# EAGLE design TeensyBreakoutBoard (EAGLE 8.6.0)
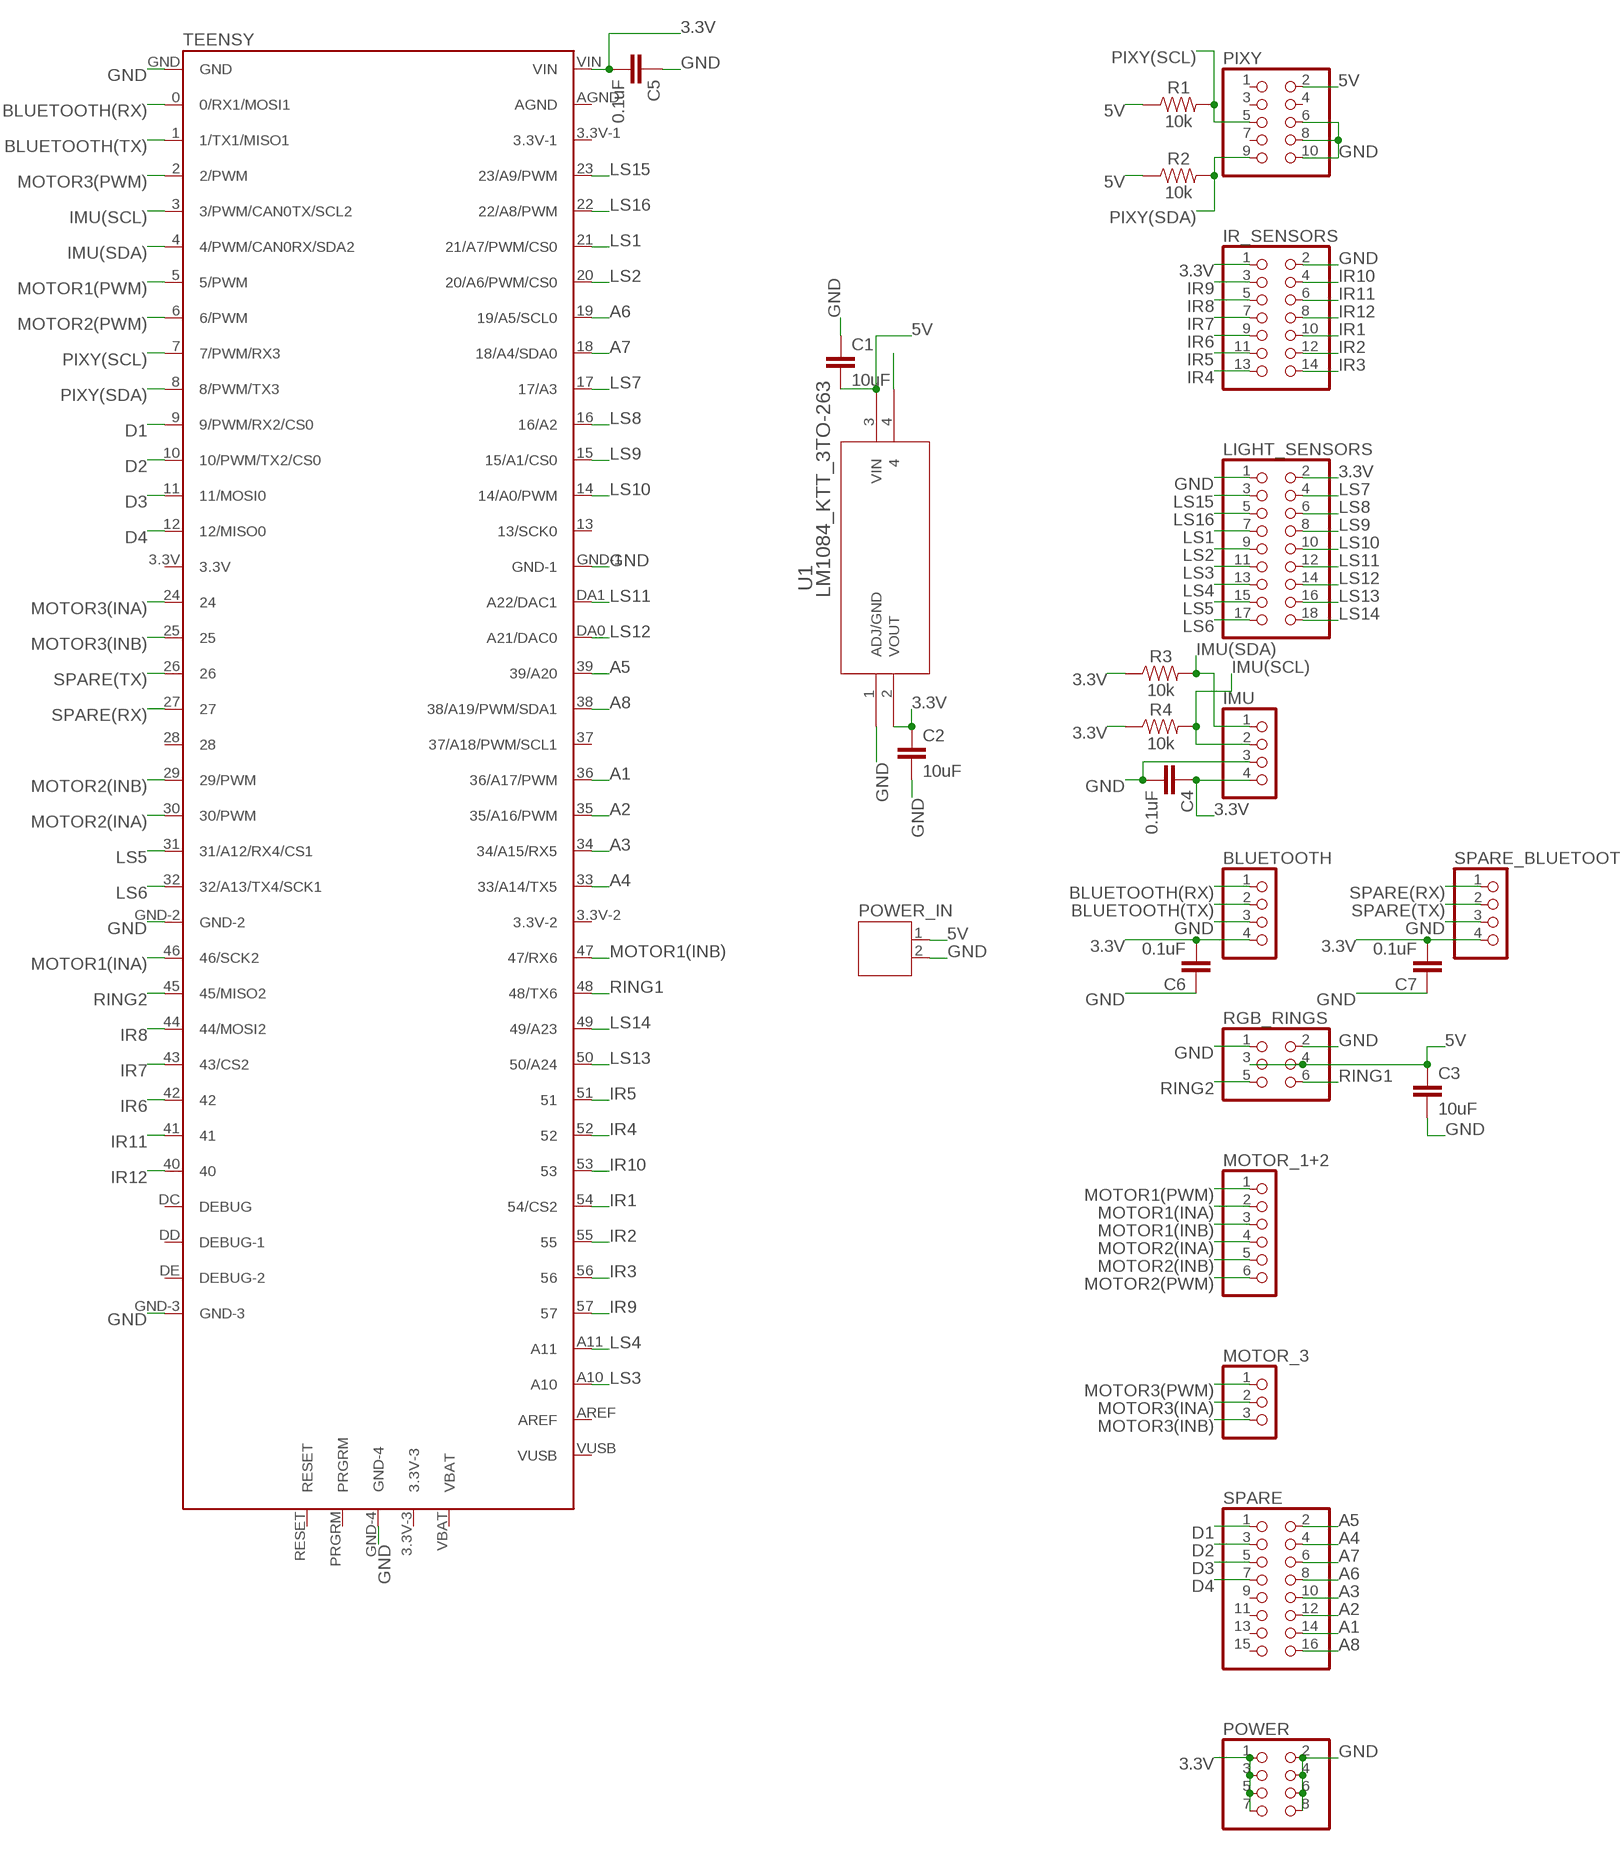
[diagram p0: schematic, sheet 1]

## Parts
BLUETOOTH  PINHD-1X4  [1X04]
C1  10uF  10UF-0805-10V-10%  [0805]
C2  10uF  10UF-0805-10V-10%  [0805]
C3  10uF  10UF-0805-10V-10%  [0805]
C4  0.1uF  0.1UF-0603-25V-(+80/-20%)  [0603]
C5  0.1uF  0.1UF-0603-25V-(+80/-20%)  [0603]
C6  0.1uF  0.1UF-0603-25V-(+80/-20%)  [0603]
C7  0.1uF  0.1UF-0603-25V-(+80/-20%)  [0603]
IMU  PINHD-1X4  [1X04]
IR_SENSORS  PINHD-2X7  [2X07]
LIGHT_SENSORS  PINHD-2X9  [2X09]
MOTOR_1+2  PINHD-1X6  [1X06]
MOTOR_3  PINHD-1X3  [1X03]
PIXY  PINHD-2X5  [2X05]
POWER  PINHD-2X4  [2X04]
POWER_IN  JST-PH2  [JST-PH2]
R1  10k  10KOHM-0603-1/10W-1%  [0603]
R2  10k  10KOHM-0603-1/10W-1%  [0603]
R3  10k  10KOHM-0603-1/10W-1%  [0603]
R4  10k  10KOHM-0603-1/10W-1%  [0603]
RGB_RINGS  PINHD-2X3  [2X03]
SPARE  PINHD-2X8  [2X08]
SPARE_BLUETOOTH  PINHD-1X4  [1X04]
TEENSY  TEENSY-3.5  [TEENSY-3.5]
U1  LM1084_KTT_3TO-263  [TS3B]

## Nets
3.3V: BLUETOOTH.4 C2.1 C4.1 C5.2 C6.2 C7.2 IMU.4 IR_SENSORS.1 LIGHT_SENSORS.2 POWER.1 POWER.3 POWER.5 POWER.7 R3.1 R4.1 SPARE_BLUETOOTH.4 TEENSY.VIN U1.2(VOUT)
5V: C1.2 C3.1 PIXY.2 POWER_IN.1 R1.1 R2.1 RGB_RINGS.3 RGB_RINGS.4 U1.3(VIN)
A1: SPARE.14 TEENSY.36(36/A17/PWM)
A2: SPARE.12 TEENSY.35(35/A16/PWM)
A3: SPARE.10 TEENSY.34(34/A15/RX5)
A4: SPARE.4 TEENSY.33(33/A14/TX5)
A5: SPARE.2 TEENSY.39(39/A20)
A6: SPARE.8 TEENSY.19(19/A5/SCL0)
A7: SPARE.6 TEENSY.18(18/A4/SDA0)
A8: SPARE.16 TEENSY.38(38/A19/PWM/SDA1)
BLUETOOTH(RX): BLUETOOTH.1 TEENSY.0(0/RX1/MOSI1)
BLUETOOTH(TX): BLUETOOTH.2 TEENSY.1(1/TX1/MISO1)
D1: SPARE.1 TEENSY.9(9/PWM/RX2/CS0)
D2: SPARE.3 TEENSY.10(10/PWM/TX2/CS0)
D3: SPARE.5 TEENSY.11(11/MOSI0)
D4: SPARE.7 TEENSY.12(12/MISO0)
GND: BLUETOOTH.3 C1.1 C2.2 C3.2 C4.2 C5.1 C6.1 C7.1 IMU.3 IR_SENSORS.2 LIGHT_SENSORS.1 PIXY.6 PIXY.8 PIXY.10 POWER.2 POWER.4 POWER.6 POWER.8 POWER_IN.2 RGB_RINGS.1 RGB_RINGS.2 SPARE_BLUETOOTH.3 TEENSY.GND TEENSY.GND-1 TEENSY.GND-2 TEENSY.GND-3 TEENSY.GND-4 U1.1(ADJ/GND)
IMU(SCL): IMU.2 R4.2 TEENSY.3(3/PWM/CAN0TX/SCL2)
IMU(SDA): IMU.1 R3.2 TEENSY.4(4/PWM/CAN0RX/SDA2)
IR1: IR_SENSORS.10 TEENSY.54(54/CS2)
IR2: IR_SENSORS.12 TEENSY.55
IR3: IR_SENSORS.14 TEENSY.56
IR4: IR_SENSORS.13 TEENSY.52
IR5: IR_SENSORS.11 TEENSY.51
IR6: IR_SENSORS.9 TEENSY.42
IR7: IR_SENSORS.7 TEENSY.43(43/CS2)
IR8: IR_SENSORS.5 TEENSY.44(44/MOSI2)
IR9: IR_SENSORS.3 TEENSY.57
IR10: IR_SENSORS.4 TEENSY.53
IR11: IR_SENSORS.6 TEENSY.41
IR12: IR_SENSORS.8 TEENSY.40
LS1: LIGHT_SENSORS.7 TEENSY.21(21/A7/PWM/CS0)
LS2: LIGHT_SENSORS.9 TEENSY.20(20/A6/PWM/CS0)
LS3: LIGHT_SENSORS.11 TEENSY.A10
LS4: LIGHT_SENSORS.13 TEENSY.A11
LS5: LIGHT_SENSORS.15 TEENSY.31(31/A12/RX4/CS1)
LS6: LIGHT_SENSORS.17 TEENSY.32(32/A13/TX4/SCK1)
LS7: LIGHT_SENSORS.4 TEENSY.17(17/A3)
LS8: LIGHT_SENSORS.6 TEENSY.16(16/A2)
LS9: LIGHT_SENSORS.8 TEENSY.15(15/A1/CS0)
LS10: LIGHT_SENSORS.10 TEENSY.14(14/A0/PWM)
LS11: LIGHT_SENSORS.12 TEENSY.DA1(A22/DAC1)
LS12: LIGHT_SENSORS.14 TEENSY.DA0(A21/DAC0)
LS13: LIGHT_SENSORS.16 TEENSY.50(50/A24)
LS14: LIGHT_SENSORS.18 TEENSY.49(49/A23)
LS15: LIGHT_SENSORS.3 TEENSY.23(23/A9/PWM)
LS16: LIGHT_SENSORS.5 TEENSY.22(22/A8/PWM)
MOTOR1(INA): MOTOR_1+2.2 TEENSY.46(46/SCK2)
MOTOR1(INB): MOTOR_1+2.3 TEENSY.47(47/RX6)
MOTOR1(PWM): MOTOR_1+2.1 TEENSY.5(5/PWM)
MOTOR2(INA): MOTOR_1+2.4 TEENSY.30(30/PWM)
MOTOR2(INB): MOTOR_1+2.5 TEENSY.29(29/PWM)
MOTOR2(PWM): MOTOR_1+2.6 TEENSY.6(6/PWM)
MOTOR3(INA): MOTOR_3.2 TEENSY.24
MOTOR3(INB): MOTOR_3.3 TEENSY.25
MOTOR3(PWM): MOTOR_3.1 TEENSY.2(2/PWM)
N$20: U1.4
PIXY(SCL): PIXY.5 R1.2 TEENSY.7(7/PWM/RX3)
PIXY(SDA): PIXY.9 R2.2 TEENSY.8(8/PWM/TX3)
RING1: RGB_RINGS.6 TEENSY.48(48/TX6)
RING2: RGB_RINGS.5 TEENSY.45(45/MISO2)
SPARE(RX): SPARE_BLUETOOTH.1 TEENSY.27
SPARE(TX): SPARE_BLUETOOTH.2 TEENSY.26
Unconnected: PIXY.1 PIXY.3 PIXY.4 PIXY.7 SPARE.9 SPARE.11 SPARE.13 SPARE.15 TEENSY.3.3V TEENSY.3.3V-1 TEENSY.3.3V-2 TEENSY.3.3V-3 TEENSY.13(13/SCK0) TEENSY.28 TEENSY.37(37/A18/PWM/SCL1) TEENSY.AGND TEENSY.AREF TEENSY.DC(DEBUG) TEENSY.DD(DEBUG-1) TEENSY.DE(DEBUG-2) TEENSY.PRGRM TEENSY.RESET TEENSY.VBAT TEENSY.VUSB

## Library data of the parts
BLUETOOTH IMU SPARE_BLUETOOTH = PinHead+:PINHD-1X4: PIN HEADER
C1-C3 = SparkFun-Capacitors:10UF: 10.0µF ceramic capacitors A capacitor is a passive two-terminal electrical component used to store electrical energy temporarily in an electric field.; PROD_ID: CAP-11330
C4-C7 = SparkFun-Capacitors:0.1UF: 0.1µF ceramic capacitors A capacitor is a passive two-terminal electrical component used to store electrical energy temporarily in an electric field.; PROD_ID: CAP-00810
IR_SENSORS = PinHead+:PINHD-2X7: PIN HEADER
LIGHT_SENSORS = PinHead+:PINHD-2X9: PIN HEADER
MOTOR_1+2 = PinHead+:PINHD-1X6: PIN HEADER
MOTOR_3 = PinHead+:PINHD-1X3: PIN HEADER
PIXY = PinHead+:PINHD-2X5: PIN HEADER
POWER = PinHead+:PINHD-2X4: PIN HEADER
POWER_IN = jst-ph:JST-PH2
R1-R4 = SparkFun-Resistors:10KOHM: 10kΩ resistor A resistor is a passive two-terminal electrical component that implements electrical resistance as a circuit element. Resistors act to reduce current flow, and, at the same time, act to lower voltage levels within circuits. - Wikipedia; PROD_ID: RES-00824
RGB_RINGS = PinHead+:PINHD-2X3: PIN HEADER
SPARE = PinHead+:PINHD-2X8: PIN HEADER
TEENSY = teensy-3.5:TEENSY-3.5
U1 = Andrew:LM1084_KTT_3; BASE_PN: LM1084; COMP: TypeLDO; LIBRARY: ReferenceLM1084IS; PARTNUMBER: LM1084IS-33; PIN: Count3; SYMBOL: NameLM1084IS-33; TYPE: LM1084IS-3.3; VENDOR: NationalSemiconductor; VERSION: 1

## Board
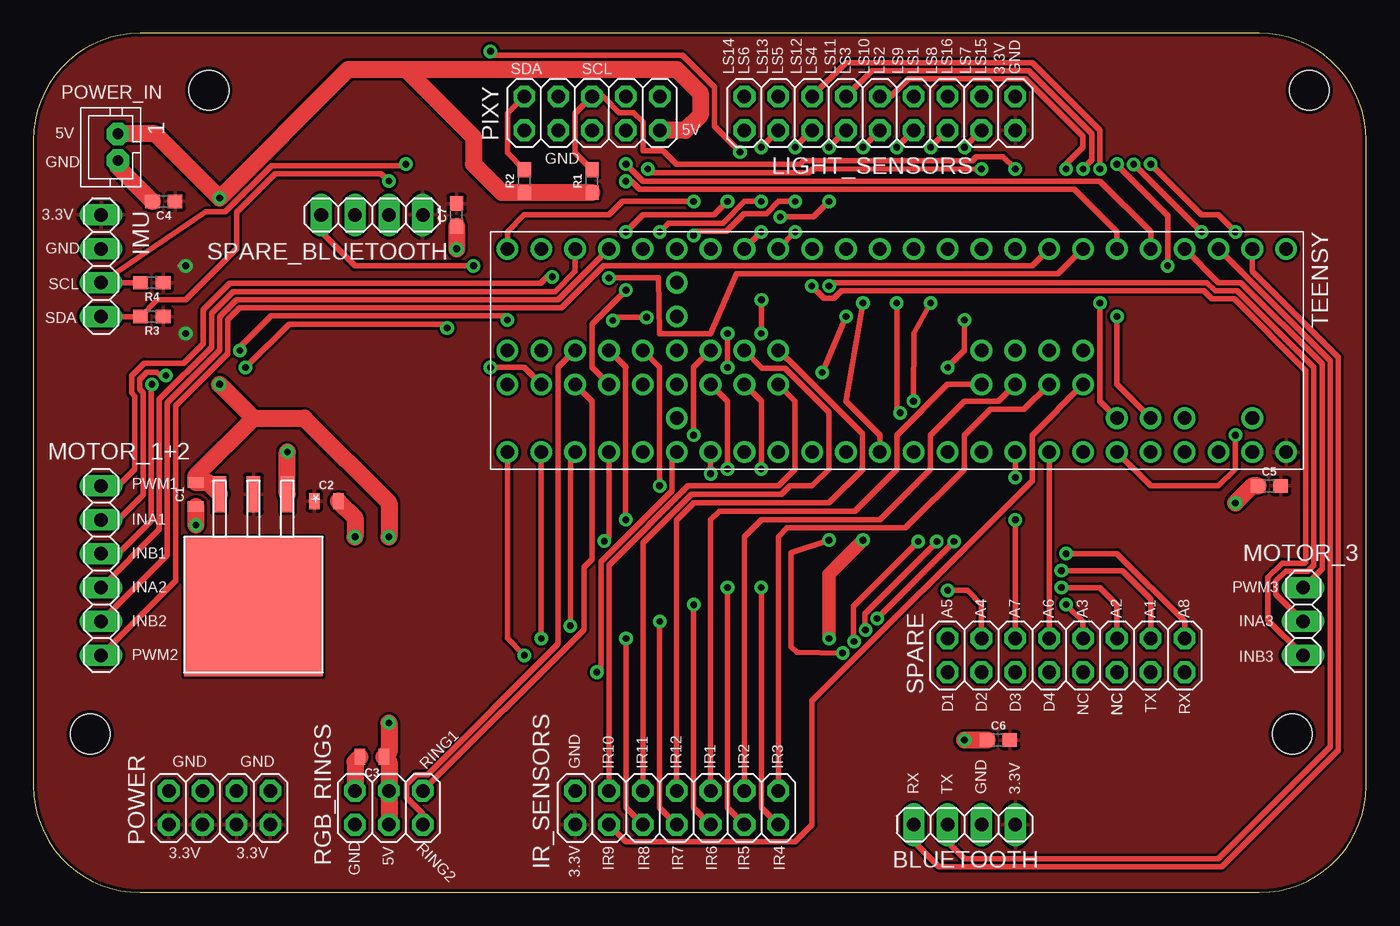
[diagram p1: board, top side]
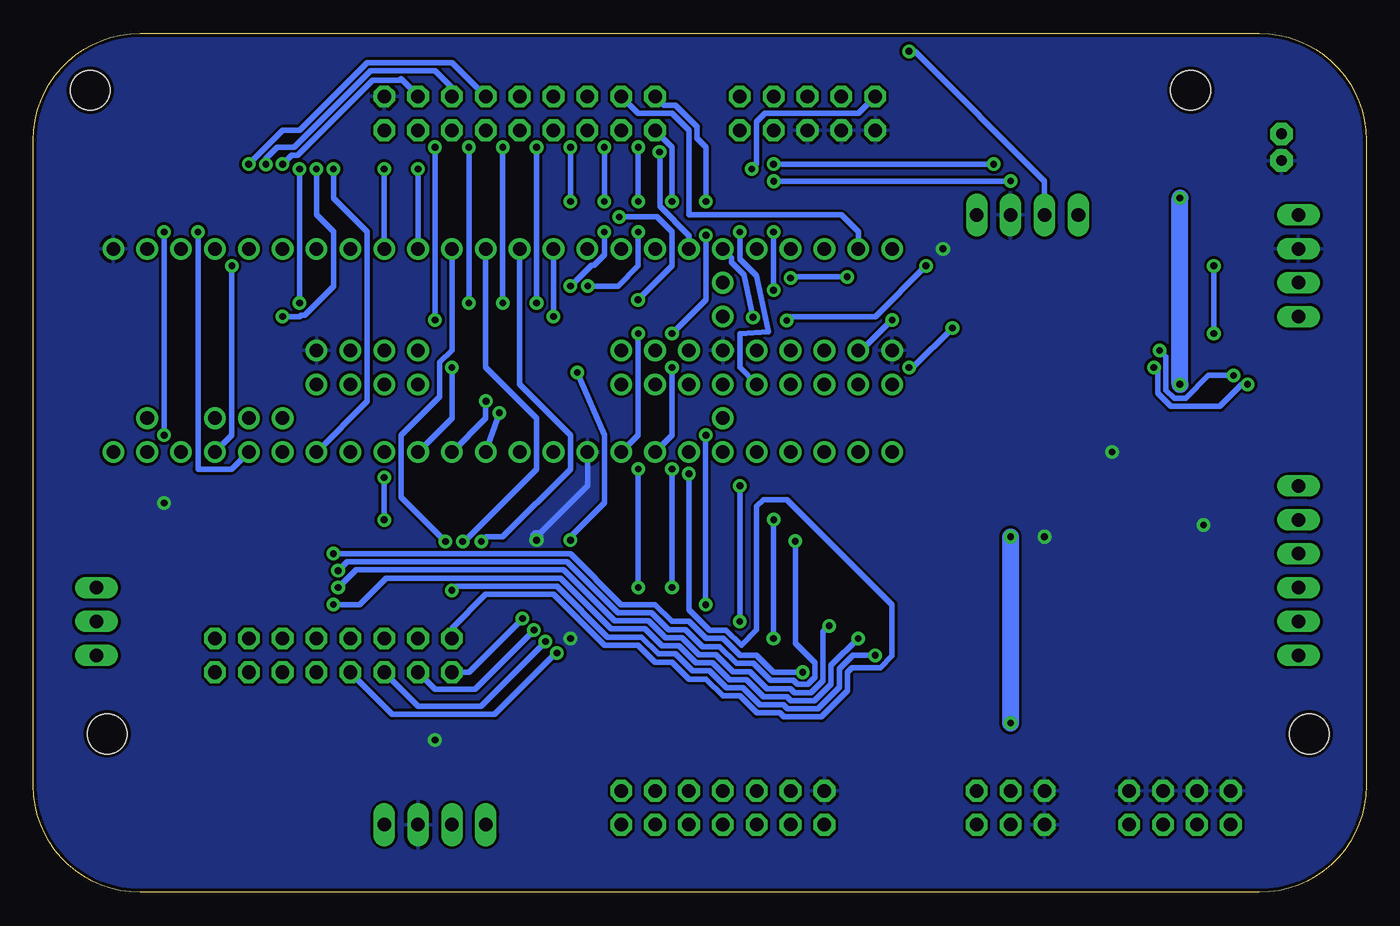
[diagram p2: board, bottom side, seen from below]

Size 99.98 x 64.42 mm. Coordinates in mm from the lower left corner, seen from the top.
Outline: 0,56.42 0,8 arc90 8,0 91.98,0 arc90 99.98,8 99.98,56.42 arc90 91.98,64.42 8,64.42 arc90 0,56.42
Copper layers (1*16): Top 0.035mm / dielectric 1.5mm / Bottom 0.035mm
Design rules "SparkFun": minimum track width 8mil, minimum drill 20mil, track to track 8mil, track to pad 8mil, pad to pad 8mil, via to via 8mil, smd to smd 8mil, copper to edge 10mil, drill to drill 8mil, minimum pad ring 12mil, minimum via ring 10mil, stop-mask expansion 4mil, vias tented up to drill 25mil, thermal gap 10mil
Holes 3 mm at 4.27,11.89 13.16,60.15 95.71,60.15 94.44,11.89

### Footprints (pad centres in the part's own frame; a part is rotated, then mirrored left to right if it is on the bottom)
1X04 = drill 1.016 long: 1 -3.81,0; 2 -1.27,0; 3 1.27,0; 4 3.81,0
0805 = smd 0.8 x 1.2: 1 -0.9,0; 2 0.9,0
0603 = smd 1.1 x 1: 1 -0.85,0; 2 0.85,0
2X07 = drill 1.016 octagon: 1 -7.62,-1.27; 2 -7.62,1.27; 3 -5.08,-1.27; 4 -5.08,1.27; 5 -2.54,-1.27; 6 -2.54,1.27; 7 0,-1.27; 8 0,1.27; 9 2.54,-1.27; 10 2.54,1.27; 11 5.08,-1.27; 12 5.08,1.27; 13 7.62,-1.27; 14 7.62,1.27
2X09 = drill 1.016 octagon: 1 -10.16,-1.27; 2 -10.16,1.27; 3 -7.62,-1.27; 4 -7.62,1.27; 5 -5.08,-1.27; 6 -5.08,1.27; 7 -2.54,-1.27; 8 -2.54,1.27; 9 0,-1.27; 10 0,1.27; 11 2.54,-1.27; 12 2.54,1.27; 13 5.08,-1.27; 14 5.08,1.27; 15 7.62,-1.27; 16 7.62,1.27; 17 10.16,-1.27; 18 10.16,1.27
1X06 = drill 1.016 long: 1 -6.35,0; 2 -3.81,0; 3 -1.27,0; 4 1.27,0; 5 3.81,0; 6 6.35,0
1X03 = drill 1.016 long: 1 -2.54,0; 2 0,0; 3 2.54,0
2X05 = drill 1.016 octagon: 1 -5.08,-1.27; 2 -5.08,1.27; 3 -2.54,-1.27; 4 -2.54,1.27; 5 0,-1.27; 6 0,1.27; 7 2.54,-1.27; 8 2.54,1.27; 9 5.08,-1.27; 10 5.08,1.27
2X04 = drill 1.016 octagon: 1 -3.81,-1.27; 2 -3.81,1.27; 3 -1.27,-1.27; 4 -1.27,1.27; 5 1.27,-1.27; 6 1.27,1.27; 7 3.81,-1.27; 8 3.81,1.27
JST-PH2 = drill 0.813 pad 1.676 octagon: 1 1,0; 2 -1,0
2X03 = drill 1.016 octagon: 1 -2.54,-1.27; 2 -2.54,1.27; 3 0,-1.27; 4 0,1.27; 5 2.54,-1.27; 6 2.54,1.27
2X08 = drill 1.016 octagon: 1 -8.89,-1.27; 2 -8.89,1.27; 3 -6.35,-1.27; 4 -6.35,1.27; 5 -3.81,-1.27; 6 -3.81,1.27; 7 -1.27,-1.27; 8 -1.27,1.27; 9 1.27,-1.27; 10 1.27,1.27; 11 3.81,-1.27; 12 3.81,1.27; 13 6.35,-1.27; 14 6.35,1.27; 15 8.89,-1.27; 16 8.89,1.27
TEENSY-3.5 = drill 1.016: 0 -7.62,26.67; 1 -7.62,24.13; 2 -7.62,21.59; 3 -7.62,19.05; 3.3V -7.62,-6.35; 3.3V-1 7.62,24.13; 3.3V-2 2.54,-29.21; 3.3V-3 -2.54,-16.51; 4 -7.62,16.51; 5 -7.62,13.97; 6 -7.62,11.43; 7 -7.62,8.89; 8 -7.62,6.35; 9 -7.62,3.81; 10 -7.62,1.27; 11 -7.62,-1.27; 12 -7.62,-3.81; 13 7.62,-3.81; 14 7.62,-1.27; 15 7.62,1.27; 16 7.62,3.81; 17 7.62,6.35; 18 7.62,8.89; 19 7.62,11.43; 20 7.62,13.97; 21 7.62,16.51; 22 7.62,19.05; 23 7.62,21.59; 24 -7.62,-8.89; 25 -7.62,-11.43; 26 -7.62,-13.97; 27 -7.62,-16.51; 28 -7.62,-19.05; 29 -7.62,-21.59; 30 -7.62,-24.13; 31 -7.62,-26.67; 32 -7.62,-29.21; 33 7.62,-29.21; 34 7.62,-26.67; 35 7.62,-24.13; 36 7.62,-21.59; 37 7.62,-19.05; 38 7.62,-16.51; 39 7.62,-13.97; 40 0,-8.89; 41 0,-11.43; 42 0,-13.97; 43 0,-19.05; 44 0,-21.59; 45 0,-24.13; 46 0,-26.67; 47 2.54,-26.67; 48 2.54,-24.13; 49 2.54,-21.59; 50 2.54,-19.05; 51 2.54,-13.97; 52 2.54,-11.43; 53 2.54,-8.89; 54 2.54,6.35; 55 2.54,8.89; 56 2.54,11.43; 57 2.54,13.97; A10 5.08,19.05; A11 5.08,16.51; AGND 7.62,26.67; AREF 5.08,21.59; DA0 7.62,-11.43; DA1 7.62,-8.89; DC 0,8.89; DD 0,6.35; DE 0,11.43; GND -7.62,29.21; GND-1 7.62,-6.35; GND-2 0,-29.21; GND-3 0,-16.51; GND-4 0,13.97; PRGRM 2.54,-16.51; RESET 5.08,-16.51; VBAT -5.08,-16.51; VIN 7.62,29.21; VUSB 5.08,26.67
TS3B = smd 1.016 x 2.692: 1 -2.54,-8.28; 2 0,-8.28; 3 2.54,-8.28 | smd 10.414 x 10.465: 4 0,0.152

### Placement (x,y rotation side)
BLUETOOTH  69.85,5.08 0 top
C1  12.19,29.84 90 top
C2  21.97,29.34 0 top
C3  25.4,10.16 180 top
C4  9.78,51.82 180 top
C5  92.71,30.48 0 top
C6  72.39,11.43 0 top
C7  31.75,50.8 90 top
IMU  5.08,46.99 90 top
IR_SENSORS  48.26,6.35 0 top
LIGHT_SENSORS  63.5,58.42 180 top
MOTOR_1+2  5.08,24.13 270 top
MOTOR_3  95.25,20.32 270 top
PIXY  41.91,58.42 180 top
POWER  13.97,6.35 0 top
POWER_IN  6.35,55.88 90 top
R1  41.91,53.34 90 top
R2  36.83,53.34 90 top
R3  8.89,43.18 180 top
R4  8.89,45.72 180 top
RGB_RINGS  26.67,6.35 0 top
SPARE  77.47,17.78 0 top
SPARE_BLUETOOTH  25.4,50.8 0 top
TEENSY  64.77,40.64 270 top
U1  16.51,21.59 180 top

### Tracks (layer width: path | path; a pad name or v marks a point on that pad's centre or on a via)
3.3V  (via drill 0.51)
  Top 0.406: 11.01,46.99 v11.43,46.99
  Bottom 0.406: v11.43,46.99 v11.43,41.91
  pour Top (rank 2): 111.76,81.28 -19.05,81.28 -27.94,72.39 -27.94,0 -15.24,-12.7 118.11,-12.7 124.46,-6.35 124.46,68.58
5V  (via drill 0.51)
  Top 1.27: 16.51,35.56 20.32,35.56 26.67,29.21 v26.67,26.67 | 16.51,35.56 v13.97,38.1 | POWER_IN.1 9.16,56.88 v13.97,52.07 23.62,61.72 27.94,61.72 | PIXY.2 48.9,57.15 50.04,58.29 50.04,59.94 48.26,61.72 27.94,61.72 | RGB_RINGS.3 RGB_RINGS.4 26.67,9.79 C3.1 26.67,10.53 v26.67,12.7 | 16.51,35.56 12.19,31.24 C1.2 13.09,30.75 U1.3 | 27.94,61.72 33.02,56.64 33.02,54.61 35.14,52.49 R2.1 R1.1
  Bottom 1.27: v13.97,38.1 v13.97,52.07 | v26.67,26.67 v26.67,12.7
A1  (via drill 0.51)
  Top 0.406: TEENSY.36 43.18,26.69 v42.82,26.34 | v77.11,24.13 81.69,24.13 83.82,22 SPARE.14
  Bottom 0.406: v42.82,26.34 42.82,18.69 41.35,17.22 41.35,16.13 41.89,15.6 42.64,15.6 42.95,15.9 44.7,15.9 45.97,17.17 47.24,17.17 48.51,18.44 49.78,18.44 51.05,19.71 52.32,19.71 53.59,20.98 56.13,20.98 59.94,24.79 76.45,24.79 v77.11,24.13
A2  (via drill 0.51)
  Top 0.406: TEENSY.35 40.28,32.66 v40.28,19.99 | v77.11,22.86 80.01,22.86 81.28,21.59 SPARE.12
  Bottom 0.406: v40.28,19.99 40.74,19.53 40.74,15.88 41.63,14.99 42.9,14.99 43.2,15.29 44.96,15.29 46.23,16.56 47.5,16.56 48.77,17.83 50.04,17.83 51.3,19.1 52.58,19.1 53.85,20.37 56.39,20.37 60.2,24.18 75.77,24.18 77.11,22.84 | 77.22,22.73 77.11,22.84 | 77.11,22.84 v77.11,22.86
A3  (via drill 0.51)
  Top 0.406: TEENSY.34 v38.1,19.05 | v77.47,21.59 78.74,20.32 SPARE.10
  Bottom 0.406: v38.1,19.05 40.13,17.02 40.13,15.63 41.38,14.38 43.15,14.38 43.45,14.68 45.21,14.68 46.48,15.95 47.75,15.95 49.02,17.22 50.29,17.22 51.56,18.49 52.83,18.49 54.1,19.76 56.64,19.76 60.45,23.57 73.53,23.57 75.51,21.59 v77.47,21.59
A4  (via drill 0.51)
  Top 0.406: TEENSY.33 35.56,19.05 v36.83,17.78 | v68.58,22.66 70.05,22.66 71.12,21.59 SPARE.4
  Bottom 0.406: v36.83,17.78 38.51,17.78 39.52,16.77 39.52,15.37 41.13,13.77 43.4,13.77 43.71,14.07 45.46,14.07 46.73,15.34 48,15.34 49.27,16.61 50.54,16.61 51.81,17.88 53.08,17.88 54.35,19.15 56.89,19.15 60.7,22.96 68.27,22.96 v68.58,22.66
A5  (via drill 0.51)
  Top 0.406: TEENSY.39 v50.8,31.39
  Bottom 0.406: v50.8,31.39 50.8,21.18 49.28,19.66 48.01,19.66 46.88,18.53 45.72,19.69 45.72,28.96 45.21,29.46 43.43,29.46 35.56,21.59 35.56,17.76 36.45,16.87 38.56,16.87 38.91,16.51 38.91,15.12 40.88,13.16 43.65,13.16 43.96,13.46 45.71,13.46 46.98,14.73 48.25,14.73 49.52,16 50.79,16 52.06,17.27 53.33,17.27 54.6,18.54 57.14,18.54 60.95,22.35 66.04,22.35 68.58,19.81 SPARE.2
A6
  Top 0.406: SPARE.8 TEENSY.19
A7  (via drill 0.51)
  Top 0.406: SPARE.6 v73.66,27.94 | v73.66,31.12 TEENSY.18
  Bottom 0.406: v73.66,27.94 v73.66,31.12
A8  (via drill 0.51)
  Top 0.406: TEENSY.38 47.89,32.65 47.89,30.11 42.57,24.79 42.57,16.51 v42.27,16.51 | v77.47,25.4 81.28,25.4 86.36,20.32 SPARE.16
  Bottom 0.406: v42.27,16.51 44.45,16.51 45.72,17.78 46.99,17.78 48.26,19.05 49.53,19.05 50.8,20.32 52.07,20.32 53.34,21.59 55.88,21.59 59.69,25.4 v77.47,25.4
BLUETOOTH(RX)
  Top 0.406: BLUETOOTH.1 66.04,3.81 67.92,1.93 89.15,1.93 97.89,10.67 97.89,40.13 91.44,46.58 TEENSY.0
BLUETOOTH(TX)
  Top 0.406: BLUETOOTH.2 68.58,3.81 69.85,2.54 88.9,2.54 97.28,10.92 97.28,39.88 TEENSY.1
D1  (via drill 0.51)
  Top 0.406: v69.06,26.31 v63.28,20.54
  Bottom 0.406: TEENSY.9 68.58,40.66 69.49,39.75 69.49,37.19 72.39,34.29 72.39,29.64 v69.06,26.31 | v63.28,20.54 67.31,16.51 SPARE.1
D2  (via drill 0.51)
  Top 0.406: v62.42,19.67 62.42,20.1 62.37,20.16 62.37,20.91 v67.77,26.31
  Bottom 0.406: TEENSY.10 66.04,39.37 62.23,35.56 62.23,31.75 67.67,26.31 v67.77,26.31 | v62.42,19.67 66.86,15.24 69.85,15.24 SPARE.3
D3  (via drill 0.51)
  Top 0.406: v61.56,18.81 61.56,19.24 61.51,19.3 61.51,21.45 v66.37,26.31
  Bottom 0.406: TEENSY.11 63.5,38.1 59.69,34.29 59.69,31.75 64.77,26.67 66.02,26.67 v66.37,26.31 | v61.56,18.81 66.4,13.97 71.12,13.97 SPARE.5
D4  (via drill 0.51)
  Top 0.406: v60.7,17.95 57.27,18 56.84,18.43 56.84,25.46 v59.69,26.42 | v60.96,43.18 v59.18,38.99
  Bottom 0.406: v59.18,38.99 57.15,34.29 57.15,29.21 59.69,26.67 v59.69,26.42 | v60.7,17.95 60.79,17.95 65.38,13.36 73.05,13.36 SPARE.7 | TEENSY.12 v60.96,43.18
GND  (via drill 0.51)
  Top 1.016: v62.23,26.42 59.69,23.88 v59.69,19.05
  Top 1.27: U1.1 v19.05,33.02 | C2.2 24.13,28.08 v24.13,26.67 | C1.1 v12.19,27.56 | C3.2 24.13,9.79 RGB_RINGS.2 | C6.1 v69.85,11.43 | C7.1 v31.75,48.26 | C4.2 6.35,54.4 POWER_IN.2 | C5.1 91.44,30.48 v90.17,29.21
  Bottom 0.406: TEENSY.GND-1 58.42,30.48 62.23,26.67
  Bottom 1.016: 62.23,26.67 v62.23,26.42
  pour Bottom: -19.05,81.28 -27.94,72.39 -27.94,-1.27 -16.51,-12.7 118.11,-12.7 124.46,-6.35 124.46,66.04 124.46,68.58 116.84,76.2 111.76,81.28
IMU(SCL)  (via drill 0.51)
  Top 0.406: v27.94,54.61 27.84,54.51 17.88,54.51 14.4,51.03 12.93,51.03 IMU.2 R4.2 | v44.45,54.61 45.72,53.34 80.01,53.34 83.82,49.53 TEENSY.3
  Bottom 0.406: v27.94,54.61 v44.45,54.61
IMU(SDA)  (via drill 0.51)
  Top 0.406: IMU.1 R3.2 9.31,44.45 11.43,44.45 15.24,48.26 15.24,51.01 18.13,53.9 26.09,53.9 26.29,53.7 26.31,53.7 v26.67,53.34 | v44.44,53.33 44.87,53.33 45.47,52.73 78.08,52.73 81.28,49.53 TEENSY.4
  Bottom 0.406: v26.67,53.34 44.43,53.34 v44.44,53.33
IR1
  Top 0.406: IR_SENSORS.10 50.8,27.94 51.46,28.6 61.62,28.6 64.77,31.75 64.77,34.29 68.58,38.1 TEENSY.54
IR2
  Top 0.406: IR_SENSORS.12 53.34,26.67 54.61,27.94 63.5,27.94 67.31,31.75 67.31,34.29 69.85,36.83 72.39,36.83 TEENSY.55
IR3
  Top 0.406: IR_SENSORS.14 55.88,26.67 56.54,27.33 65.43,27.33 69.85,31.75 69.85,34.29 71.78,36.22 74.32,36.22 TEENSY.56
IR4  (via drill 0.51)
  Top 0.406: IR_SENSORS.13 54.61,6.35 v54.61,22.86 | TEENSY.52 54.61,36.83 v54.61,31.75
  Bottom 0.406: v54.61,22.86 v54.61,31.75
IR5  (via drill 0.51)
  Top 0.406: IR_SENSORS.11 52.07,6.35 v52.07,22.86 | TEENSY.51 52.07,36.83 v52.07,31.75
  Bottom 0.406: v52.07,22.86 v52.07,31.75
IR6  (via drill 0.51)
  Top 0.406: IR_SENSORS.9 49.53,6.35 49.53,21.57 v49.54,21.58 | v49.53,34.29 49.53,39.37 TEENSY.42
  Bottom 0.406: v49.54,21.58 49.54,34.28 v49.53,34.29
IR7  (via drill 0.51)
  Top 0.406: IR_SENSORS.7 46.99,6.35 v46.99,20.32 | v46.98,30.49 46.98,39.36 46.99,39.37 TEENSY.43
  Bottom 0.406: v46.99,20.32 v46.99,30.48 v46.98,30.49
IR8  (via drill 0.51)
  Top 0.406: IR_SENSORS.5 44.45,6.35 44.45,19.03 v44.46,19.04 | v44.44,27.95 44.44,39.36 44.45,39.37 TEENSY.44
  Bottom 0.406: v44.46,19.04 44.46,27.93 v44.44,27.95
IR9
  Top 0.406: IR_SENSORS.3 44.45,3.81 57.15,3.81 58.42,5.08 58.42,14.38 74.93,30.89 74.93,34.29 TEENSY.57
IR10
  Top 0.406: IR_SENSORS.4 43.18,24.54 49.12,30.48 55.88,30.48 57.15,31.75 57.15,36.83 TEENSY.53
IR11
  Top 0.406: IR_SENSORS.6 45.72,26.22 49.38,29.87 56.13,29.87 56.74,30.48 58.42,30.48 59.69,31.75 59.69,36.01 56.39,39.32 54.66,39.32 TEENSY.41
IR12
  Top 0.406: IR_SENSORS.8 48.26,27.89 49.58,29.21 59.69,29.21 62.23,31.75 62.18,31.8 62.18,34.39 56.64,39.93 56.59,39.93 TEENSY.40
LS1  (via drill 0.51)
  Top 0.406: v83.82,54.61 87.63,50.8 88.9,50.8 v90.17,49.53 | v90.17,34.29 90.17,31.75 88.9,30.48 83.82,30.48 TEENSY.21
  Bottom 0.406: LIGHT_SENSORS.7 68.58,62.23 74.93,62.23 80.01,57.15 81.28,57.15 v83.82,54.61 | v90.17,49.53 v90.17,34.29
LS2  (via drill 0.51)
  Top 0.406: LIGHT_SENSORS.9 64.32,59.69 65.64,61.01 74.42,61.01 78.74,56.7 78.74,55.88 77.47,54.61 v77.47,54.25
  Bottom 0.406: v77.47,54.25 77.47,52.07 74.93,49.53 74.93,36.83 TEENSY.20
LS3  (via drill 0.51)
  Top 0.406: LIGHT_SENSORS.11 62.89,61.62 74.68,61.62 79.4,56.9 79.4,54.94 79.1,54.63 79.1,54.61 v78.74,54.25 | v81.28,43.18 81.28,38.1 TEENSY.A10
  Bottom 0.406: v78.74,54.25 78.74,50.8 77.47,49.53 77.47,45.44 79.63,43.28 79.91,43.28 80.01,43.18 v81.28,43.18
LS4  (via drill 0.51)
  Top 0.406: LIGHT_SENSORS.13 60.96,62.23 74.93,62.23 80.01,57.15 v80.01,54.25 | v80.01,44.2 80.01,36.83 TEENSY.A11
  Bottom 0.406: v80.01,54.25 v80.01,44.2
LS5
  Bottom 0.406: LIGHT_SENSORS.15 54.61,58.42 52.07,58.42 50.8,57.15 50.8,50.8 39.37,50.8 38.1,49.53 TEENSY.31
LS6  (via drill 0.51)
  Top 0.406: v49.53,51.82 44.2,51.82 43.18,50.8 36.83,50.8 35.56,49.53 TEENSY.32
  Bottom 0.406: v49.53,51.82 49.53,55.88 50.19,56.54 50.19,57.4 51.82,59.03 52.68,59.03 LIGHT_SENSORS.17
LS7  (via drill 0.51)
  Top 0.406: LIGHT_SENSORS.4 v69.85,55.88 | v69.85,42.93 69.85,40.64 v68.58,39.37
  Bottom 0.406: TEENSY.17 68.58,35.56 v68.58,39.37 | v69.85,55.88 v69.85,42.93
LS8  (via drill 0.51)
  Top 0.406: LIGHT_SENSORS.6 v67.31,55.88 | v67.31,44.2 66.04,41.93 v66.03,36.84
  Bottom 0.406: v66.03,36.84 v66.04,36.83 66.04,35.56 TEENSY.16 | v67.31,55.88 v67.31,44.2
LS9  (via drill 0.51)
  Top 0.406: LIGHT_SENSORS.8 v64.77,55.88 | v64.77,44.2 64.77,36.34 v65.02,35.96
  Bottom 0.406: v65.02,35.96 66.04,33.04 TEENSY.15 | v64.77,55.88 v64.77,44.2
LS10  (via drill 0.51)
  Top 0.406: LIGHT_SENSORS.10 v62.23,55.88 | v62.23,44.2 60.96,36.83 63.5,34.29 TEENSY.14
  Bottom 0.406: v62.23,55.88 v62.23,44.2
LS11  (via drill 0.51)
  Top 0.406: LIGHT_SENSORS.12 v59.69,55.88 | v59.69,51.82 58.52,50.65 v56.03,50.65 | v54.62,44.44 54.62,43.18 v54.61,41.91
  Bottom 0.406: v59.69,55.88 v59.69,51.82 | v56.03,50.65 53.19,50.65 52.07,49.53 52.07,46.99 v54.62,44.44 | v54.61,41.91 54.61,34.29 TEENSY.DA1
LS12  (via drill 0.51)
  Top 0.406: LIGHT_SENSORS.14 v57.15,55.88 | v49.53,49.28 49.84,49.58 51.99,49.58 53.31,50.9 54.99,50.9 55.9,51.82 v57.15,51.82 | v52.07,41.91 v52.07,39.37
  Bottom 0.406: v49.53,49.28 49.53,44.45 v52.07,41.91 | v52.07,39.37 52.07,34.29 TEENSY.DA0 | v57.15,55.88 v57.15,51.82
LS13  (via drill 0.51)
  Top 0.406: LIGHT_SENSORS.16 v54.61,55.88 | v46.99,49.53 47.65,50.19 51.74,50.19 53.36,51.82 v54.61,51.82
  Bottom 0.406: v46.99,49.53 46.99,47.5 45.72,46.23 44.83,42.04 46.99,41.91 46.99,39.37 TEENSY.50 | v54.61,55.88 v54.61,51.82
LS14  (via drill 0.51)
  Top 0.406: v52.07,51.82 51.05,50.8 45.72,50.8 v44.45,49.53 | v44.45,45.16 41.91,42.62 41.91,39.37 TEENSY.49
  Bottom 0.406: v52.07,51.82 52.07,55.88 LIGHT_SENSORS.18 | v44.45,49.53 v44.45,45.16
LS15  (via drill 0.51)
  Top 0.406: v81.28,54.61 81.62,54.27 81.62,54.22 85.09,50.75 v85.09,46.99
  Bottom 0.406: LIGHT_SENSORS.3 71.12,59.74 72.39,61.01 72.49,60.91 74.53,60.91 80.16,55.27 80.62,55.27 v81.28,54.61 | v85.09,46.99 85.09,34.29 TEENSY.23
LS16  (via drill 0.51)
  Top 0.406: v82.54,54.6 87.61,49.53 v87.63,49.53
  Bottom 0.406: LIGHT_SENSORS.5 68.58,60.35 69.85,61.62 74.68,61.62 80.42,55.88 81.69,55.88 82.54,55.03 v82.54,54.6 | v87.63,49.53 87.63,31.75 85.09,31.75 TEENSY.22
MOTOR1(INA)  (via drill 0.51)
  Top 0.406: MOTOR_1+2.2 6.35,27.94 8.23,29.82 8.23,37.47 7.98,37.72 7.98,38.48 8.51,39.01 9.27,39.01 9.51,38.77 v9.94,38.77 | v15.49,40.64 15.49,40.89 17.83,43.23 35.51,43.23 35.56,43.18 v35.56,42.93
  Bottom 0.406: v15.49,40.64 15.01,40.16 15.01,37.67 14.4,37.06 13.54,37.06 11.83,38.77 v9.94,38.77 | v35.56,42.93 37.85,40.64 TEENSY.46
MOTOR1(INB)  (via drill 0.51)
  Top 0.406: MOTOR_1+2.3 6.35,25.4 8.84,27.89 8.84,38.05 v8.89,38.1 | v15.93,39.37 19.18,42.62 30.48,42.62 30.73,42.62 | v34.29,39.37 36.83,39.37 TEENSY.47 | 30.73,42.62 31.04,42.62 | 30.73,42.62 v31.04,42.32
  Bottom 0.406: v8.89,38.1 9.32,38.1 10.97,36.45 14.65,36.45 15.62,37.42 15.62,39.06 v15.93,39.37 | v31.04,42.32 33.99,39.37 v34.29,39.37
MOTOR1(PWM)  (via drill 0.51)
  Top 0.406: MOTOR_1+2.1 6.35,30.48 7.62,31.75 7.62,37.22 7.37,37.47 7.37,38.73 8.32,39.68 11.29,39.68 12.75,41.15 12.75,43.69 14.73,45.67 38.05,45.67 38.54,46.16 v38.93,46.16 | v43.18,46.08 46.89,46.08 46.99,41.91 50.8,41.91 52.73,46.38 76.86,46.38 TEENSY.5
  Bottom 0.406: v38.93,46.16 43.09,46.16 v43.18,46.08
MOTOR2(INA)
  Top 0.406: MOTOR_1+2.4 9.45,27.23 9.45,36.98 13.36,40.89 13.36,43.43 14.99,45.06 39.12,45.06 40.64,46.58 TEENSY.30
MOTOR2(INB)
  Top 0.406: MOTOR_1+2.5 10.06,25.3 10.06,36.73 13.97,40.64 13.97,43.18 15.24,44.45 39.37,44.45 TEENSY.29
MOTOR2(PWM)
  Top 0.406: MOTOR_1+2.6 10.67,23.37 10.67,36.48 14.58,40.39 14.58,42.93 15.49,43.84 39.62,43.84 42.77,46.99 74.93,46.99 TEENSY.6
MOTOR3(INA)  (via drill 0.51)
  Top 0.406: MOTOR_3.2 93.22,22.36 93.22,23.37 93.93,24.08 95.61,24.08 96.06,24.54 96.06,39.37 90.33,45.11 88.65,45.11 88.04,45.72 74.93,45.72 59.94,45.72 v59.69,45.47 | v57.15,49.53 TEENSY.24
  Bottom 0.406: v59.69,45.47 58.12,47.04 57.92,47.04 57.15,47.81 v57.15,49.53
MOTOR3(INB)  (via drill 0.51)
  Top 0.406: MOTOR_3.3 92.61,20.43 92.61,23.62 93.68,24.69 95.35,24.69 95.45,24.79 95.45,39.12 90.07,44.5 88.39,44.5 87.78,45.11 60.63,45.11 60.07,44.55 59.31,44.55 v58.4,45.47 | v54.61,49.53 TEENSY.25
  Bottom 0.406: v58.4,45.47 56.13,45.47 54.61,46.99 v54.61,49.53
MOTOR3(PWM)
  Top 0.406: MOTOR_3.1 96.67,24.28 96.67,39.62 90.58,45.72 88.9,45.72 TEENSY.2
PIXY(SCL)  (via drill 0.51)
  Top 0.406: R1.2 40.64,55.46 40.64,58.42 PIXY.5 42.73,59.69 43.95,58.47 45.03,58.47 45.72,57.79 45.72,55.63 47.24,55.63 48.26,54.61 57.53,54.61 57.79,54.86 70.44,54.86 70.74,55.17 72.75,55.17 v73.66,54.25
  Bottom 0.406: v73.66,54.25 TEENSY.7
PIXY(SDA)  (via drill 0.51)
  Top 0.406: PIXY.9 35.56,58.42 35.56,55.46 R2.2 | v46.1,54.25 46.38,53.98 58.17,53.98 58.42,54.23 58.55,54.23 v71.12,54.25
  Bottom 0.406: PIXY.9 38.1,58.42 45.09,58.42 45.72,57.79 45.72,54.63 v46.1,54.25 | v71.12,54.25 TEENSY.8
RING1
  Top 0.406: RGB_RINGS.6 41.3,19.71 41.3,24.38 41.91,24.99 41.91,36.83 TEENSY.48
RING2
  Top 0.406: RGB_RINGS.5 29.21,5.9 27.99,7.12 27.99,8.12 28.7,8.84 29.57,8.84 39.37,18.64 39.37,39.37 TEENSY.45
SPARE(RX)  (via drill 0.51)
  Top 0.406: v46,43.12 43.7,43.12 v43.47,42.89 | v33.02,46.99 24.13,46.99 21.59,49.53 SPARE_BLUETOOTH.1
  Bottom 0.406: TEENSY.27 47.6,47.6 47.6,47.24 46.67,46.32 v46,43.12 | v43.47,42.89 43.18,43.18 36.83,43.18 v33.02,46.99
SPARE(TX)  (via drill 0.51)
  Top 0.406: v53.01,55.52 51.08,57.45 51.08,60.38 48.69,62.76 34.6,62.76 v34.29,63.07
  Bottom 0.406: TEENSY.26 50.8,49.25 52.98,51.44 52.98,55.5 v53.01,55.52 | v34.29,63.07 33.86,63.07 24.13,53.34 SPARE_BLUETOOTH.2

### Text on the board
tPlace: SDA | SCL | LS14 | LS6 | LS13 | LS5 | LS12 | LS4 | LS11 | LS3 | LS10 | LS2 | LS9 | LS1 | LS8 | LS16 | LS7 | LS15 | 3.3V | GND | 5V | 5V | GND | GND | 3.3V | GND | SCL | SDA | PWM1 | INA1 | INB1 | INA2 | PWM3 | A5 | A4 | A7 | A6 | A3 | A2 | A1 | A8 | INB2 | INA3 | PWM2 | INB3 | D1 | D2 | D3 | D4 | NC | NC | NC | TX | RX | GND | GND | RING1 | GND | IR10 | IR11 | IR12 | IR1 | IR2 | IR3 | RX | TX | GND | 3.3V | 3.3V | 3.3V | 5V | IR9 | IR8 | IR7 | IR6 | IR5 | IR4 | GND | RING2 | 3.3V